# Altium schematic sheet Artemis HS Expansion Connector.SchDoc: High Speed Expansion Connector
size Tabloid; Date: 7/17/2014; CompanyName: Cospan Design LLC; DocumentNumber: 12; SheetNumber: 12; SheetTotal: 18
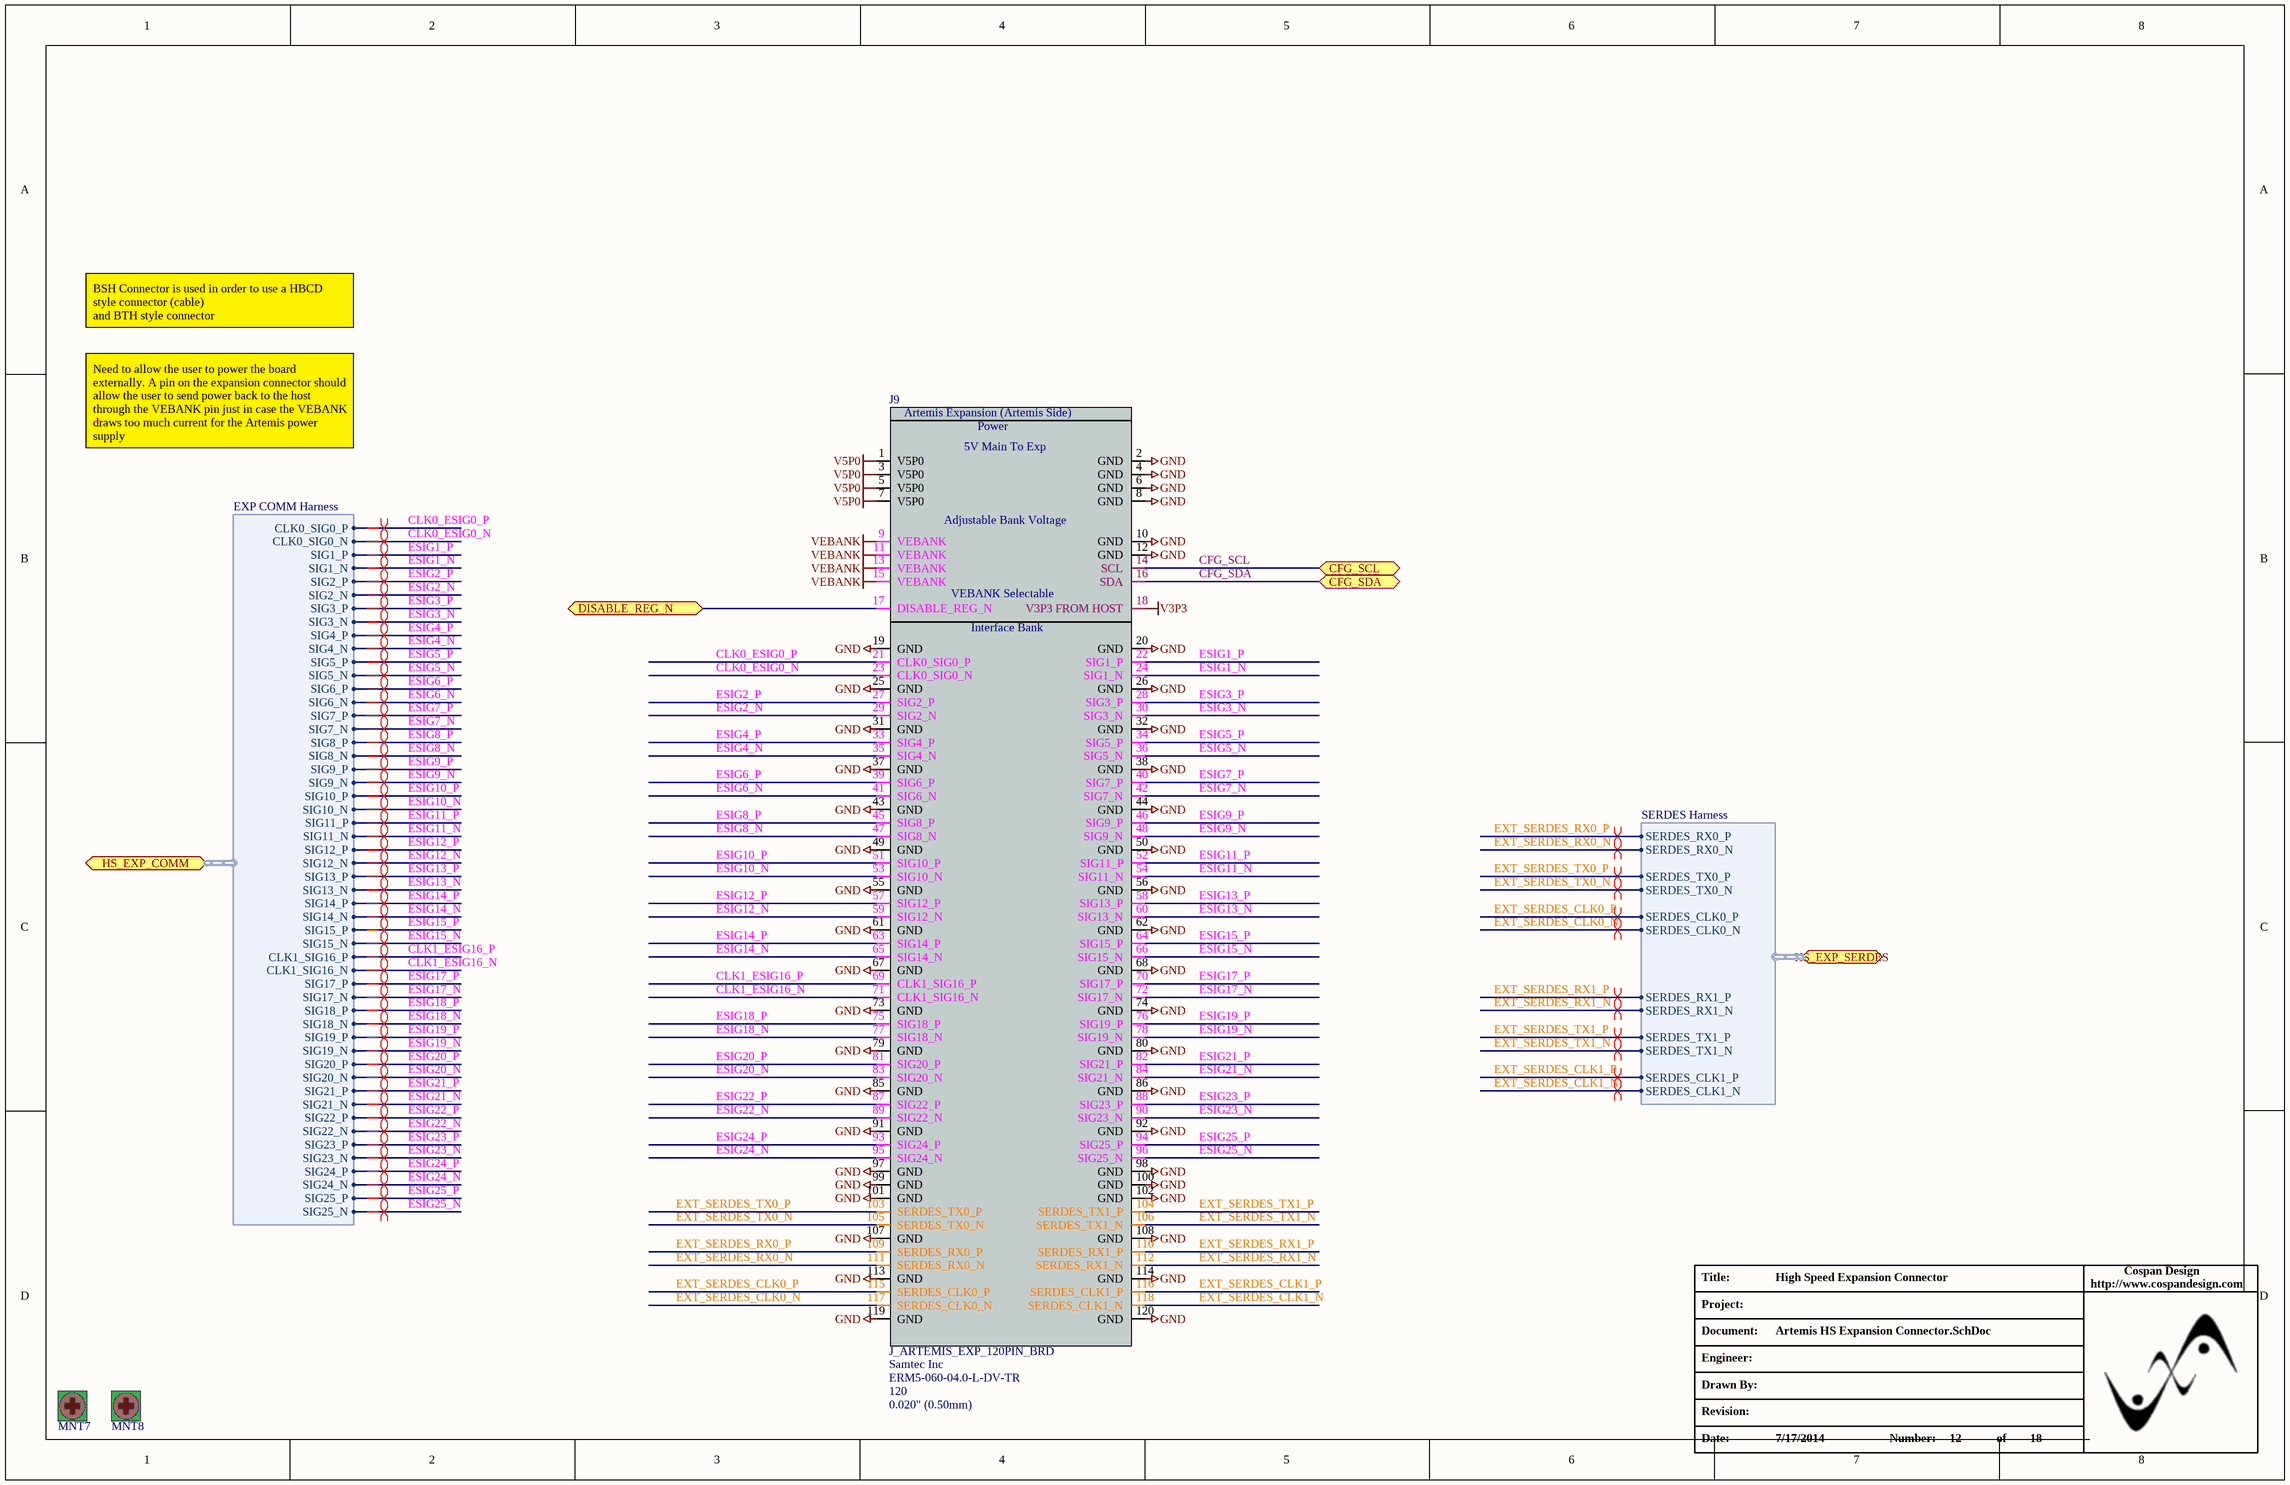
[diagram p0: Artemis HS Expansion Connector.SchDoc]

## Parts
J9  J_ARTEMIS_EXP_120PIN_BRD  Manufacturer: Samtec Inc  Number of Positions: 120  Pitch: 0.020" (0.50mm)  [ERM5-060-04.0-L-DV-TR]
MNT7  Mounting Hole  [MNT_4-40]  (value not drawn)  (no BOM)
MNT8  Mounting Hole  [MNT_4-40]  (value not drawn)  (no BOM)

## Ports
CFG_SCL, CFG_SDA, DISABLE_REG_N, HS_EXP_COMM (harness EXP COMM Harness), HS_EXP_SERDES (harness SERDES Harness)

## Harnesses
EXP COMM Harness: CLK0_SIG0_P, CLK0_SIG0_N, SIG1_P, SIG1_N, SIG2_P, SIG2_N, SIG3_P, SIG3_N, SIG4_P, SIG4_N, SIG5_P, SIG5_N, SIG6_P, SIG6_N, SIG7_P, SIG7_N, SIG8_P, SIG8_N, SIG9_P, SIG9_N, SIG10_P, SIG10_N, SIG11_P, SIG11_N, SIG12_P, SIG12_N, SIG13_P, SIG13_N, SIG14_P, SIG14_N, SIG15_P, SIG15_N, CLK1_SIG16_P, CLK1_SIG16_N, SIG17_P, SIG17_N, SIG18_P, SIG18_N, SIG19_P, SIG19_N, SIG20_P, SIG20_N, SIG21_P, SIG21_N, SIG22_P, SIG22_N, SIG23_P, SIG23_N, SIG24_P, SIG24_N, SIG25_P, SIG25_N
SERDES Harness: SERDES_RX0_P, SERDES_RX0_N, SERDES_TX0_P, SERDES_TX0_N, SERDES_CLK0_P, SERDES_CLK0_N, SERDES_RX1_P, SERDES_RX1_N, SERDES_TX1_P, SERDES_TX1_N, SERDES_CLK1_P, SERDES_CLK1_N

## Nets
GND: J9.2(GND) J9.4(GND) J9.6(GND) J9.8(GND) J9.10(GND) J9.12(GND) J9.19(GND) J9.20(GND) J9.25(GND) J9.26(GND) J9.31(GND) J9.32(GND) J9.37(GND) J9.38(GND) J9.43(GND) J9.44(GND) J9.49(GND) J9.50(GND) J9.55(GND) J9.56(GND) J9.61(GND) J9.62(GND) J9.67(GND) J9.68(GND) J9.73(GND) J9.74(GND) J9.79(GND) J9.80(GND) J9.85(GND) J9.86(GND) J9.91(GND) J9.92(GND) J9.97(GND) J9.98(GND) J9.99(GND) J9.100(GND) J9.101(GND) J9.102(GND) J9.107(GND) J9.108(GND) J9.113(GND) J9.114(GND) J9.119(GND) J9.120(GND)
V3P3: J9.18(V3P3_FROM_HOST)
V5P0: J9.1(V5P0) J9.3(V5P0) J9.5(V5P0) J9.7(V5P0)
VEBANK: J9.9(VEBANK) J9.11(VEBANK) J9.13(VEBANK) J9.15(VEBANK)
CFG_SCL: J9.14(SCL) ; port CFG_SCL
CFG_SDA: J9.16(SDA) ; port CFG_SDA
CLK0_ESIG0_N: J9.23(CLK0_SIG0_N) ; port HS_EXP_COMM.CLK0_SIG0_N
CLK0_ESIG0_P: J9.21(CLK0_SIG0_P) ; port HS_EXP_COMM.CLK0_SIG0_P
CLK1_ESIG16_N: J9.71(CLK1_SIG16_N) ; port HS_EXP_COMM.CLK1_SIG16_N
CLK1_ESIG16_P: J9.69(CLK1_SIG16_P) ; port HS_EXP_COMM.CLK1_SIG16_P
DISABLE_REG_N: J9.17(DISABLE_REG_N) ; port DISABLE_REG_N
ESIG1_N: J9.24(SIG1_N) ; port HS_EXP_COMM.SIG1_N
ESIG1_P: J9.22(SIG1_P) ; port HS_EXP_COMM.SIG1_P
ESIG2_N: J9.29(SIG2_N) ; port HS_EXP_COMM.SIG2_N
ESIG2_P: J9.27(SIG2_P) ; port HS_EXP_COMM.SIG2_P
ESIG3_N: J9.30(SIG3_N) ; port HS_EXP_COMM.SIG3_N
ESIG3_P: J9.28(SIG3_P) ; port HS_EXP_COMM.SIG3_P
ESIG4_N: J9.35(SIG4_N) ; port HS_EXP_COMM.SIG4_N
ESIG4_P: J9.33(SIG4_P) ; port HS_EXP_COMM.SIG4_P
ESIG5_N: J9.36(SIG5_N) ; port HS_EXP_COMM.SIG5_N
ESIG5_P: J9.34(SIG5_P) ; port HS_EXP_COMM.SIG5_P
ESIG6_N: J9.41(SIG6_N) ; port HS_EXP_COMM.SIG6_N
ESIG6_P: J9.39(SIG6_P) ; port HS_EXP_COMM.SIG6_P
ESIG7_N: J9.42(SIG7_N) ; port HS_EXP_COMM.SIG7_N
ESIG7_P: J9.40(SIG7_P) ; port HS_EXP_COMM.SIG7_P
ESIG8_N: J9.47(SIG8_N) ; port HS_EXP_COMM.SIG8_N
ESIG8_P: J9.45(SIG8_P) ; port HS_EXP_COMM.SIG8_P
ESIG9_N: J9.48(SIG9_N) ; port HS_EXP_COMM.SIG9_N
ESIG9_P: J9.46(SIG9_P) ; port HS_EXP_COMM.SIG9_P
ESIG10_N: J9.53(SIG10_N) ; port HS_EXP_COMM.SIG10_N
ESIG10_P: J9.51(SIG10_P) ; port HS_EXP_COMM.SIG10_P
ESIG11_N: J9.54(SIG11_N) ; port HS_EXP_COMM.SIG11_N
ESIG11_P: J9.52(SIG11_P) ; port HS_EXP_COMM.SIG11_P
ESIG12_N: J9.59(SIG12_N) ; port HS_EXP_COMM.SIG12_N
ESIG12_P: J9.57(SIG12_P) ; port HS_EXP_COMM.SIG12_P
ESIG13_N: J9.60(SIG13_N) ; port HS_EXP_COMM.SIG13_N
ESIG13_P: J9.58(SIG13_P) ; port HS_EXP_COMM.SIG13_P
ESIG14_N: J9.65(SIG14_N) ; port HS_EXP_COMM.SIG14_N
ESIG14_P: J9.63(SIG14_P) ; port HS_EXP_COMM.SIG14_P
ESIG15_N: J9.66(SIG15_N) ; port HS_EXP_COMM.SIG15_N
ESIG15_P: J9.64(SIG15_P) ; port HS_EXP_COMM.SIG15_P
ESIG17_N: J9.72(SIG17_N) ; port HS_EXP_COMM.SIG17_N
ESIG17_P: J9.70(SIG17_P) ; port HS_EXP_COMM.SIG17_P
ESIG18_N: J9.77(SIG18_N) ; port HS_EXP_COMM.SIG18_N
ESIG18_P: J9.75(SIG18_P) ; port HS_EXP_COMM.SIG18_P
ESIG19_N: J9.78(SIG19_N) ; port HS_EXP_COMM.SIG19_N
ESIG19_P: J9.76(SIG19_P) ; port HS_EXP_COMM.SIG19_P
ESIG20_N: J9.83(SIG20_N) ; port HS_EXP_COMM.SIG20_N
ESIG20_P: J9.81(SIG20_P) ; port HS_EXP_COMM.SIG20_P
ESIG21_N: J9.84(SIG21_N) ; port HS_EXP_COMM.SIG21_N
ESIG21_P: J9.82(SIG21_P) ; port HS_EXP_COMM.SIG21_P
ESIG22_N: J9.89(SIG22_N) ; port HS_EXP_COMM.SIG22_N
ESIG22_P: J9.87(SIG22_P) ; port HS_EXP_COMM.SIG22_P
ESIG23_N: J9.90(SIG23_N) ; port HS_EXP_COMM.SIG23_N
ESIG23_P: J9.88(SIG23_P) ; port HS_EXP_COMM.SIG23_P
ESIG24_N: J9.95(SIG24_N) ; port HS_EXP_COMM.SIG24_N
ESIG24_P: J9.93(SIG24_P) ; port HS_EXP_COMM.SIG24_P
ESIG25_N: J9.96(SIG25_N) ; port HS_EXP_COMM.SIG25_N
ESIG25_P: J9.94(SIG25_P) ; port HS_EXP_COMM.SIG25_P
EXT_SERDES_CLK0_N: J9.117(SERDES_CLK0_N) ; port HS_EXP_SERDES.SERDES_CLK0_N
EXT_SERDES_CLK0_P: J9.115(SERDES_CLK0_P) ; port HS_EXP_SERDES.SERDES_CLK0_P
EXT_SERDES_CLK1_N: J9.118(SERDES_CLK1_N) ; port HS_EXP_SERDES.SERDES_CLK1_N
EXT_SERDES_CLK1_P: J9.116(SERDES_CLK1_P) ; port HS_EXP_SERDES.SERDES_CLK1_P
EXT_SERDES_RX0_N: J9.111(SERDES_RX0_N) ; port HS_EXP_SERDES.SERDES_RX0_N
EXT_SERDES_RX0_P: J9.109(SERDES_RX0_P) ; port HS_EXP_SERDES.SERDES_RX0_P
EXT_SERDES_RX1_N: J9.112(SERDES_RX1_N) ; port HS_EXP_SERDES.SERDES_RX1_N
EXT_SERDES_RX1_P: J9.110(SERDES_RX1_P) ; port HS_EXP_SERDES.SERDES_RX1_P
EXT_SERDES_TX0_N: J9.105(SERDES_TX0_N) ; port HS_EXP_SERDES.SERDES_TX0_N
EXT_SERDES_TX0_P: J9.103(SERDES_TX0_P) ; port HS_EXP_SERDES.SERDES_TX0_P
EXT_SERDES_TX1_N: J9.106(SERDES_TX1_N) ; port HS_EXP_SERDES.SERDES_TX1_N
EXT_SERDES_TX1_P: J9.104(SERDES_TX1_P) ; port HS_EXP_SERDES.SERDES_TX1_P

## Layout directives
differential pair: CLK0_ESIG0_N, CLK0_ESIG0_P, CLK1_ESIG16_N, CLK1_ESIG16_P, ESIG1_N, ESIG1_P, ESIG2_N, ESIG2_P, ESIG3_N, ESIG3_P, ESIG4_N, ESIG4_P, ESIG5_N, ESIG5_P, ESIG6_N, ESIG6_P, ESIG7_N, ESIG7_P, ESIG8_N, ESIG8_P, ESIG9_N, ESIG9_P, ESIG10_N, ESIG10_P, ESIG11_N, ESIG11_P, ESIG12_N, ESIG12_P, ESIG13_N, ESIG13_P, ESIG14_N, ESIG14_P, ESIG15_N, ESIG15_P, ESIG17_N, ESIG17_P, ESIG18_N, ESIG18_P, ESIG19_N, ESIG19_P, ESIG20_N, ESIG20_P, ESIG21_N, ESIG21_P, ESIG22_N, ESIG22_P, ESIG23_N, ESIG23_P, ESIG24_N, ESIG24_P, ESIG25_N, ESIG25_P, EXT_SERDES_CLK0_N, EXT_SERDES_CLK0_P, EXT_SERDES_CLK1_N, EXT_SERDES_CLK1_P, EXT_SERDES_RX0_N, EXT_SERDES_RX0_P, EXT_SERDES_RX1_N, EXT_SERDES_RX1_P, EXT_SERDES_TX0_N, EXT_SERDES_TX0_P, EXT_SERDES_TX1_N, EXT_SERDES_TX1_P

## Notes on the sheet
- BSH Connector is used in order to use a HBCD style connector (cable)
  and BTH style connector
- Need to allow the user to power the board externally. A pin on the expansion connector should allow the user to send power back to the host through the VEBANK pin just in case the VEBANK draws too much current for the Artemis power supply
- Title:
- http://www.cospandesign.com
- Cospan Design
- Project:
- Document:
- Engineer:
- Revision:
- Drawn By:
- Date:
- Number:
- of
- (in symbol J_ARTEMIS_EXP_120PIN_BRD) Artemis Expansion (Artemis Side); Power; 5V Main To Exp; Adjustable Bank Voltage; VEBANK Selectable; Interface Bank

## Library data of the parts
J9 = J_ARTEMIS_EXP_120PIN_BRD: CONN HDR 120POS 0.5MM SMD; Manufacturer Part Number: ERM5-060-04.0-L-DV-TR
MNT7 MNT8 = MNT_440_HOLE